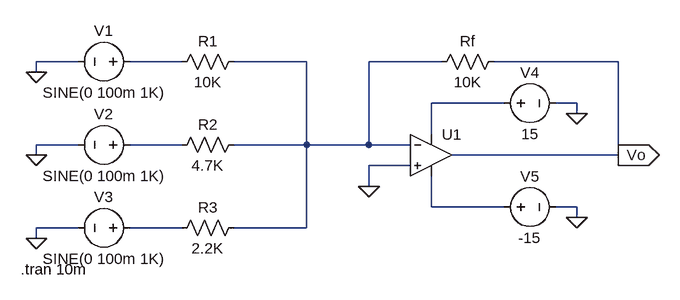
[diagram p0: schematic Run_4.asc]
Run_4.asc, the LTspice schematic file:
Version 4
SHEET 1 880 680
WIRE -272 -32 -336 -32
WIRE -112 -32 -192 -32
WIRE 80 -32 -32 -32
WIRE 288 -32 176 -32
WIRE 560 -32 368 -32
WIRE -336 -16 -336 -32
WIRE 384 32 272 32
WIRE 496 32 464 32
WIRE 496 48 496 32
WIRE 272 80 272 32
WIRE -272 96 -336 96
WIRE -112 96 -192 96
WIRE 80 96 80 -32
WIRE 80 96 -32 96
WIRE 176 96 176 -32
WIRE 176 96 80 96
WIRE 240 96 176 96
WIRE -336 112 -336 96
WIRE 560 112 560 -32
WIRE 560 112 304 112
WIRE 240 128 176 128
WIRE 176 160 176 128
WIRE 272 192 272 144
WIRE 384 192 272 192
WIRE 496 192 464 192
WIRE 496 208 496 192
WIRE -272 224 -336 224
WIRE -112 224 -192 224
WIRE 80 224 80 96
WIRE 80 224 -32 224
WIRE -336 240 -336 224
FLAG -336 -16 0
FLAG -336 112 0
FLAG -336 240 0
FLAG 176 160 0
FLAG 496 48 0
FLAG 496 208 0
FLAG 560 112 Vo
IOPIN 560 112 Out
SYMBOL res -16 -48 R90
WINDOW 0 0 56 VBottom 2
WINDOW 3 32 56 VTop 2
SYMATTR InstName R1
SYMATTR Value 10K
SYMBOL voltage -176 -32 R90
WINDOW 0 -32 56 VBottom 2
WINDOW 3 32 56 VTop 2
WINDOW 123 0 0 Left 0
WINDOW 39 0 0 Left 0
SYMATTR InstName V1
SYMATTR Value SINE(0 100m 1K)
SYMBOL voltage -176 96 R90
WINDOW 0 -32 56 VBottom 2
WINDOW 3 32 56 VTop 2
WINDOW 123 0 0 Left 0
WINDOW 39 0 0 Left 0
SYMATTR InstName V2
SYMATTR Value SINE(0 100m 1K)
SYMBOL voltage -176 224 R90
WINDOW 0 -32 56 VBottom 2
WINDOW 3 32 56 VTop 2
WINDOW 123 0 0 Left 0
WINDOW 39 0 0 Left 0
SYMATTR InstName V3
SYMATTR Value SINE(0 100m 1K)
SYMBOL res -16 80 R90
WINDOW 0 0 56 VBottom 2
WINDOW 3 32 56 VTop 2
SYMATTR InstName R2
SYMATTR Value 4.7K
SYMBOL res -16 208 R90
WINDOW 0 0 56 VBottom 2
WINDOW 3 32 56 VTop 2
SYMATTR InstName R3
SYMATTR Value 2.2K
SYMBOL res 384 -48 R90
WINDOW 0 0 56 VBottom 2
WINDOW 3 32 56 VTop 2
SYMATTR InstName Rf
SYMATTR Value 10K
SYMBOL OpAmps\\UniversalOpamp2 272 112 R0
SYMATTR InstName U1
SYMBOL voltage 368 32 R270
WINDOW 0 32 56 VTop 2
WINDOW 3 -32 56 VBottom 2
WINDOW 123 0 0 Left 0
WINDOW 39 0 0 Left 0
SYMATTR InstName V4
SYMATTR Value 15
SYMBOL voltage 368 192 R270
WINDOW 0 32 56 VTop 2
WINDOW 3 -32 56 VBottom 2
WINDOW 123 0 0 Left 0
WINDOW 39 0 0 Left 0
SYMATTR InstName V5
SYMATTR Value -15
TEXT -360 288 Left 2 !.tran 10m

The netlist it stands for:
* Run_4.asc
R1 N002 N001 10K
V1 N001 0 SINE(0 100m 1K)
V2 N004 0 SINE(0 100m 1K)
V3 N006 0 SINE(0 100m 1K)
R2 N002 N004 4.7K
R3 N002 N006 2.2K
Rf Vo N002 10K
XU1 0 N002 N003 N005 Vo level.2 Avol=1Meg GBW=10Meg Slew=10Meg ilimit=25m rail=0 Vos=0 phimargin=45 en=0 enk=0 in=0 ink=0 Rin=500Meg  ; pins IN+ IN- V+ V- OUT
V4 N003 0 15
V5 N005 0 -15
.tran 10m
.lib UniversalOpamps2.sub
.backanno
.end